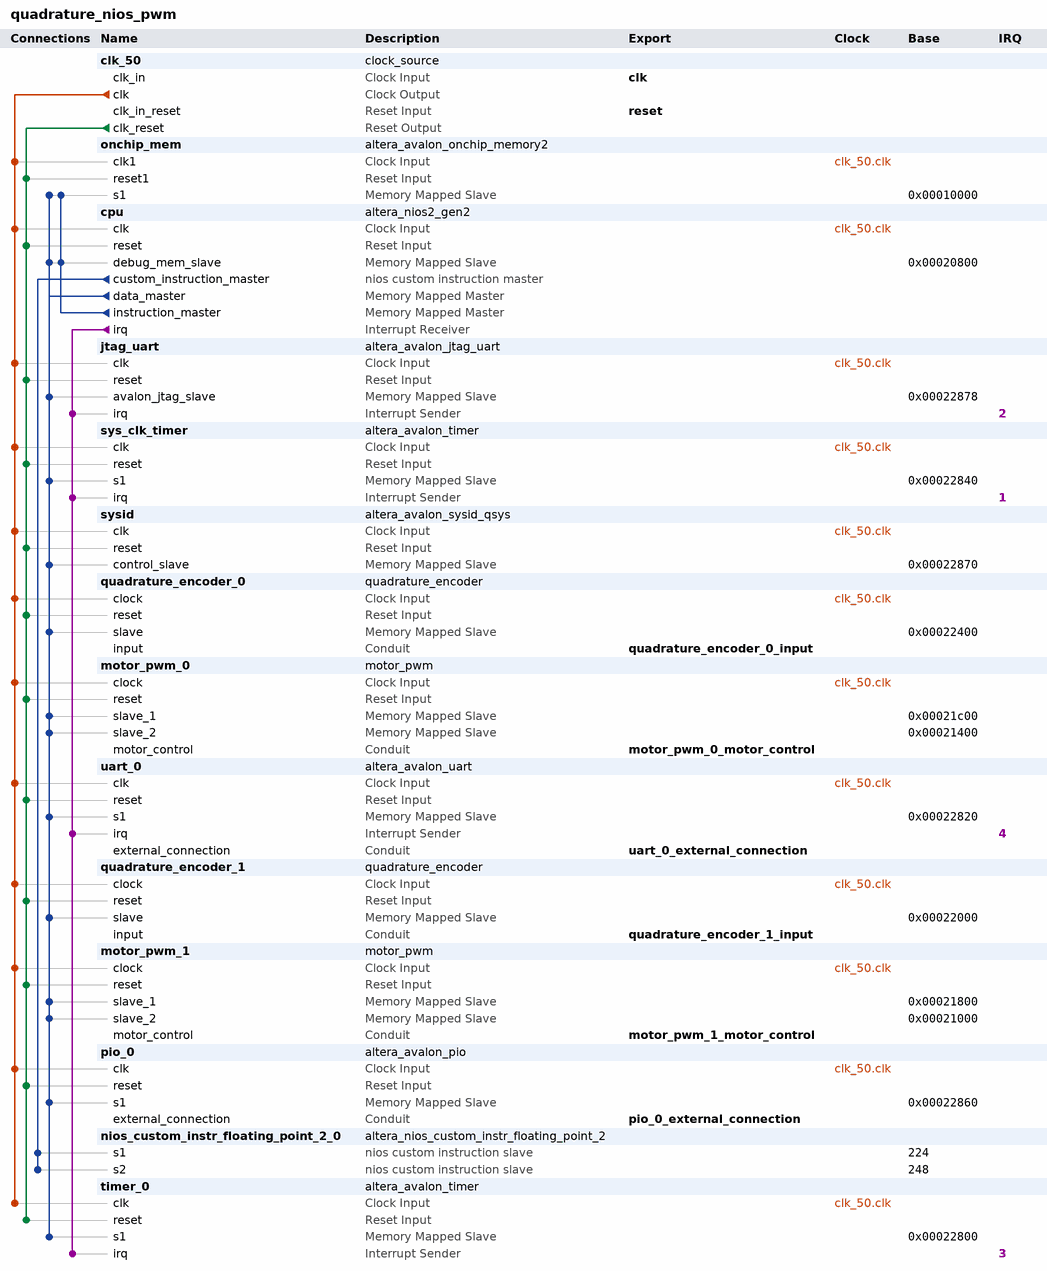
[diagram p0: system contents]
# Platform Designer (Qsys) system quadrature_nios_pwm, Cyclone IV E EP4CE22F17C6
# Parameters at their usual value, and those the tool derives, are not listed.
package require -exact qsys 20.1
create_system quadrature_nios_pwm
set_project_property DEVICE_FAMILY {Cyclone IV E}
set_project_property DEVICE EP4CE22F17C6

add_instance clk_50 clock_source 20.1
set_instance_parameter_value clk_50 clockFrequency 50000000

add_instance onchip_mem altera_avalon_onchip_memory2 20.1
set_instance_parameter_value onchip_mem dataWidth 32
set_instance_parameter_value onchip_mem dualPort false
set_instance_parameter_value onchip_mem initMemContent true
set_instance_parameter_value onchip_mem initializationFileName onchip_mem.hex
set_instance_parameter_value onchip_mem memorySize 46080

add_instance cpu altera_nios2_gen2 20.1
set_instance_parameter_value cpu dcache_size 2048
set_instance_parameter_value cpu exceptionSlave onchip_mem.s1
set_instance_parameter_value cpu icache_size 2048
set_instance_parameter_value cpu impl Tiny
set_instance_parameter_value cpu mul_32_impl 0
set_instance_parameter_value cpu mul_shift_choice 1
set_instance_parameter_value cpu resetSlave onchip_mem.s1

add_instance jtag_uart altera_avalon_jtag_uart 20.1
set_instance_parameter_value jtag_uart simInteractiveOptions NO_INTERACTIVE_WINDOWS

add_instance sys_clk_timer altera_avalon_timer 20.1
set_instance_parameter_value sys_clk_timer period 1
set_instance_parameter_value sys_clk_timer periodUnits MSEC

add_instance sysid altera_avalon_sysid_qsys 20.1
set_instance_parameter_value sysid id 0

add_instance quadrature_encoder_0 quadrature_encoder 1.2
set_instance_parameter_value quadrature_encoder_0 DATA_WIDTH 32

add_instance motor_pwm_0 motor_pwm 1.2
set_instance_parameter_value motor_pwm_0 DATA_WIDTH 32
set_instance_parameter_value motor_pwm_0 DUTY 16

add_instance uart_0 altera_avalon_uart 20.1
set_instance_parameter_value uart_0 baud 115200
set_instance_parameter_value uart_0 dataBits 8
set_instance_parameter_value uart_0 fixedBaud true
set_instance_parameter_value uart_0 parity NONE
set_instance_parameter_value uart_0 stopBits 1

add_instance quadrature_encoder_1 quadrature_encoder 1.2
set_instance_parameter_value quadrature_encoder_1 DATA_WIDTH 32

add_instance motor_pwm_1 motor_pwm 1.2
set_instance_parameter_value motor_pwm_1 DATA_WIDTH 32
set_instance_parameter_value motor_pwm_1 DUTY 16

add_instance pio_0 altera_avalon_pio 20.1
set_instance_parameter_value pio_0 direction Output
set_instance_parameter_value pio_0 width 8

add_instance nios_custom_instr_floating_point_2_0 altera_nios_custom_instr_floating_point_2 20.1
set_instance_parameter_value nios_custom_instr_floating_point_2_0 arithmetic_present true
set_instance_parameter_value nios_custom_instr_floating_point_2_0 comparison_present true
set_instance_parameter_value nios_custom_instr_floating_point_2_0 conversion_present true
set_instance_parameter_value nios_custom_instr_floating_point_2_0 root_present false

add_instance timer_0 altera_avalon_timer 20.1
set_instance_parameter_value timer_0 period 100
set_instance_parameter_value timer_0 periodUnits USEC

# connections
add_connection clk_50.clk cpu.clk clock
add_connection clk_50.clk jtag_uart.clk clock
add_connection clk_50.clk motor_pwm_0.clock clock
add_connection clk_50.clk motor_pwm_1.clock clock
add_connection clk_50.clk onchip_mem.clk1 clock
add_connection clk_50.clk pio_0.clk clock
add_connection clk_50.clk quadrature_encoder_0.clock clock
add_connection clk_50.clk quadrature_encoder_1.clock clock
add_connection clk_50.clk sys_clk_timer.clk clock
add_connection clk_50.clk sysid.clk clock
add_connection clk_50.clk timer_0.clk clock
add_connection clk_50.clk uart_0.clk clock
add_connection clk_50.clk_reset cpu.reset reset
add_connection clk_50.clk_reset jtag_uart.reset reset
add_connection clk_50.clk_reset motor_pwm_0.reset reset
add_connection clk_50.clk_reset motor_pwm_1.reset reset
add_connection clk_50.clk_reset onchip_mem.reset1 reset
add_connection clk_50.clk_reset pio_0.reset reset
add_connection clk_50.clk_reset quadrature_encoder_0.reset reset
add_connection clk_50.clk_reset quadrature_encoder_1.reset reset
add_connection clk_50.clk_reset sys_clk_timer.reset reset
add_connection clk_50.clk_reset sysid.reset reset
add_connection clk_50.clk_reset timer_0.reset reset
add_connection clk_50.clk_reset uart_0.reset reset
add_connection cpu.data_master cpu.debug_mem_slave avalon
set_connection_parameter_value cpu.data_master/cpu.debug_mem_slave baseAddress 0x00020800
add_connection cpu.data_master jtag_uart.avalon_jtag_slave avalon
set_connection_parameter_value cpu.data_master/jtag_uart.avalon_jtag_slave baseAddress 0x00022878
add_connection cpu.data_master motor_pwm_0.slave_1 avalon
set_connection_parameter_value cpu.data_master/motor_pwm_0.slave_1 baseAddress 0x00021c00
add_connection cpu.data_master motor_pwm_0.slave_2 avalon
set_connection_parameter_value cpu.data_master/motor_pwm_0.slave_2 baseAddress 0x00021400
add_connection cpu.data_master motor_pwm_1.slave_1 avalon
set_connection_parameter_value cpu.data_master/motor_pwm_1.slave_1 baseAddress 0x00021800
add_connection cpu.data_master motor_pwm_1.slave_2 avalon
set_connection_parameter_value cpu.data_master/motor_pwm_1.slave_2 baseAddress 0x00021000
add_connection cpu.data_master onchip_mem.s1 avalon
set_connection_parameter_value cpu.data_master/onchip_mem.s1 baseAddress 0x00010000
add_connection cpu.data_master pio_0.s1 avalon
set_connection_parameter_value cpu.data_master/pio_0.s1 baseAddress 0x00022860
add_connection cpu.data_master quadrature_encoder_0.slave avalon
set_connection_parameter_value cpu.data_master/quadrature_encoder_0.slave baseAddress 0x00022400
add_connection cpu.data_master quadrature_encoder_1.slave avalon
set_connection_parameter_value cpu.data_master/quadrature_encoder_1.slave baseAddress 0x00022000
add_connection cpu.data_master sys_clk_timer.s1 avalon
set_connection_parameter_value cpu.data_master/sys_clk_timer.s1 baseAddress 0x00022840
add_connection cpu.data_master sysid.control_slave avalon
set_connection_parameter_value cpu.data_master/sysid.control_slave baseAddress 0x00022870
add_connection cpu.data_master timer_0.s1 avalon
set_connection_parameter_value cpu.data_master/timer_0.s1 baseAddress 0x00022800
add_connection cpu.data_master uart_0.s1 avalon
set_connection_parameter_value cpu.data_master/uart_0.s1 baseAddress 0x00022820
add_connection cpu.instruction_master cpu.debug_mem_slave avalon
set_connection_parameter_value cpu.instruction_master/cpu.debug_mem_slave baseAddress 0x00020800
add_connection cpu.instruction_master onchip_mem.s1 avalon
set_connection_parameter_value cpu.instruction_master/onchip_mem.s1 baseAddress 0x00010000
add_connection cpu.irq jtag_uart.irq interrupt
set_connection_parameter_value cpu.irq/jtag_uart.irq irqNumber 2
add_connection cpu.irq sys_clk_timer.irq interrupt
set_connection_parameter_value cpu.irq/sys_clk_timer.irq irqNumber 1
add_connection cpu.irq timer_0.irq interrupt
set_connection_parameter_value cpu.irq/timer_0.irq irqNumber 3
add_connection cpu.irq uart_0.irq interrupt
set_connection_parameter_value cpu.irq/uart_0.irq irqNumber 4
add_connection cpu.custom_instruction_master nios_custom_instr_floating_point_2_0.s1 nios_custom_instruction
set_connection_parameter_value cpu.custom_instruction_master/nios_custom_instr_floating_point_2_0.s1 CIName nios_custom_instr_floating_point_2_0
set_connection_parameter_value cpu.custom_instruction_master/nios_custom_instr_floating_point_2_0.s1 baseAddress 224
add_connection cpu.custom_instruction_master nios_custom_instr_floating_point_2_0.s2 nios_custom_instruction
set_connection_parameter_value cpu.custom_instruction_master/nios_custom_instr_floating_point_2_0.s2 CIName nios_custom_instr_floating_point_2_0_1
set_connection_parameter_value cpu.custom_instruction_master/nios_custom_instr_floating_point_2_0.s2 baseAddress 248

# exported interfaces
add_interface clk clock sink
set_interface_property clk EXPORT_OF clk_50.clk_in
add_interface motor_pwm_0_motor_control conduit end
set_interface_property motor_pwm_0_motor_control EXPORT_OF motor_pwm_0.motor_control
add_interface motor_pwm_1_motor_control conduit end
set_interface_property motor_pwm_1_motor_control EXPORT_OF motor_pwm_1.motor_control
add_interface pio_0_external_connection conduit end
set_interface_property pio_0_external_connection EXPORT_OF pio_0.external_connection
add_interface quadrature_encoder_0_input conduit end
set_interface_property quadrature_encoder_0_input EXPORT_OF quadrature_encoder_0.input
add_interface quadrature_encoder_1_input conduit end
set_interface_property quadrature_encoder_1_input EXPORT_OF quadrature_encoder_1.input
add_interface reset reset sink
set_interface_property reset EXPORT_OF clk_50.clk_in_reset
add_interface uart_0_external_connection conduit end
set_interface_property uart_0_external_connection EXPORT_OF uart_0.external_connection

set_interconnect_requirement {$system} qsys_mm.clockCrossingAdapter HANDSHAKE
set_interconnect_requirement {$system} qsys_mm.enableEccProtection FALSE
set_interconnect_requirement {$system} qsys_mm.insertDefaultSlave FALSE
set_interconnect_requirement {$system} qsys_mm.maxAdditionalLatency 1

save_system quadrature_nios_pwm.qsys
